# Altium schematic sheet 20_DC_Link.SchDoc
size A4; SheetNumber: 3; SheetTotal: 4
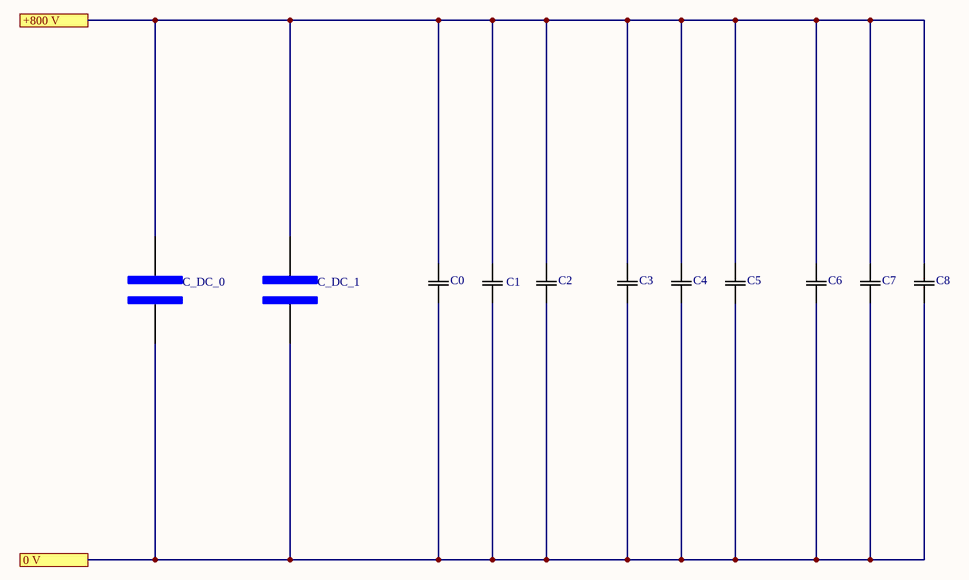
[diagram p0: 20_DC_Link.SchDoc]

## Parts
C0  2220Y1K00474KETWS2  [CAP_2220Y_KNO]  (value not drawn)
C1  2220Y1K00474KETWS2  [CAP_2220Y_KNO]  (value not drawn)
C2  2220Y1K00474KETWS2  [CAP_2220Y_KNO]  (value not drawn)
C3  2220Y1K00474KETWS2  [CAP_2220Y_KNO]  (value not drawn)
C4  2220Y1K00474KETWS2  [CAP_2220Y_KNO]  (value not drawn)
C5  2220Y1K00474KETWS2  [CAP_2220Y_KNO]  (value not drawn)
C6  2220Y1K00474KETWS2  [CAP_2220Y_KNO]  (value not drawn)
C7  2220Y1K00474KETWS2  [CAP_2220Y_KNO]  (value not drawn)
C8  2220Y1K00474KETWS2  [CAP_2220Y_KNO]  (value not drawn)
C_DC_0  B25654A6177K001  [B25654A6177K001]  (value not drawn)
C_DC_1  B25654A6177K001  [B25654A6177K001]  (value not drawn)

## Ports
0 V (see 00_TopLevel, 10_Phase, 30_HV_Connectors), +800 V (see 00_TopLevel, 10_Phase, 30_HV_Connectors)

## Nets
0 V: C0.1 C1.1 C2.1 C3.1 C4.1 C5.1 C6.1 C7.1 C8.1 C_DC_0.2 C_DC_1.2 ; port 0 V
+800 V: C0.2 C1.2 C2.2 C3.2 C4.2 C5.2 C6.2 C7.2 C8.2 C_DC_0.1 C_DC_1.1 ; port +800 V

## Library data of the parts
C0-C8 = 2220Y1K00474KETWS2: Description; Manufacturer_Name: Knowles; Type: Ceramic Capacitors; Copyright: Copyright (C) 2026 Ultra Librarian. All rights reserved.; Manufacturer_Part_Number: 2220Y1K00474KETWS2